# Altium schematic sheet 0.9V REG.SchDoc
size A; SheetNumber: 11; SheetTotal: 11
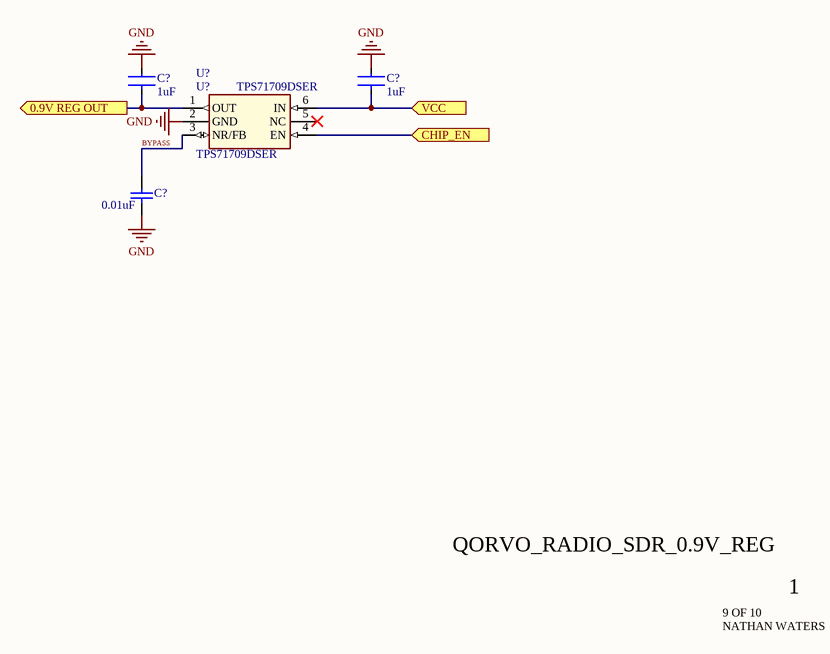
[diagram p0: 0.9V REG.SchDoc]

## Parts
(Parts that share a designator on the sheet are numbered #1, #2 ... from top to bottom, then left to right.)
C?#1  CAPACITANCE: 1uF  [FP-GRM155-0_1-MFG]  (hidden comment: GRM155R61H105KE05D)
C?#2  CAPACITANCE: 1uF  [FP-GRM155-0_1-MFG]  (hidden comment: GRM155R61H105KE05D)
C?#3  Capacitance: 0.01uF  [CAPC1005X55X25LL05T10]  (hidden comment: GRM155R71C103KA01D)
U?  TPS71709DSER  [TPS71709DSER]

## Ports
0.9V REG OUT (out, see AA[4C]), CHIP_EN (in, see 3.3v REG[3B], HE Mixer[2C], LE Mixer[2C], LO[1B]), VCC (in, see 3.3v REG[3B], AA[1B], AA[2B], HE LNA[3A], HE Mixer[3C], LE LNA[3A], LE Mixer[3C], LPF[1B], SWITCH[3B])

## Nets
GND: C?#1.2 C?#2.2 C?#3.2 U?.2(GND)
0.9V REG OUT: C?#1.1 U?.1(OUT) ; port 0.9V REG OUT
BYPASS: C?#3.1 U?.3(NR/FB)
CHIP_EN: U?.4(EN) ; port CHIP_EN
VCC: C?#2.1 U?.6(IN) ; port VCC

Not connected (* = marked no-connect by the designer): U? 5(NC)*

## Notes on the sheet
- QORVO_RADIO_SDR_0.9V_REG
- 9 OF 10
- 1
- NATHAN WATERS

## Library data of the parts
C?#1 C?#2 = CMP-06035-026840-2: CERAMIC CAP, MLCC 1UF 50VDC X5R
C?#3 = CMP-2000-06332-1: Chip Capacitor, 10 nF, 16 V, 10%, -55 to 125 degC, 0402 (1005 Metric), RoHS, Tape and Reel; Manufacturer: Murata; Rated Voltage: 16V; Dielectric: X7R; Manufacturer URL: http://www.murata.com/; Package Description: 2-Pin Surface Mount Device, Body 1 x 0.5 mm; Case Size/Dimension: 0402; Tolerance (%): ±10%; Datasheet Version: 06/2016; Package Reference: 0402; Mounting Technology: SurfaceMount; Datasheet URL: http://psearch.en.murata.com/capacitor/product/GRM155R71C103KA01%23.pdf
U? = TPS71709DSER: VOLT REG 0.9V; Mfr_Name: Texas Instruments; Manufacturer_part_number: TPS71733DSER; Data Sheet Link: https://www.ti.com/lit/ds/symlink/tps717.pdf?HQS=dis-dk-null-digikeymode-dsf-pf-null-wwe&ts=1731440412035&ref_url=https%253A%252F%252Fwww.ti.com%252Fgeneral%252Fdocs%252Fsuppproductinfo.tsp%253FdistId%253D10%2526gotoUrl%253Dhttps%253A%252F%252Fwww.ti.com%252Flit%252Fgpn%252Ftps717